# EAGLE schematic Polaczenia (EAGLE 9.6.2)
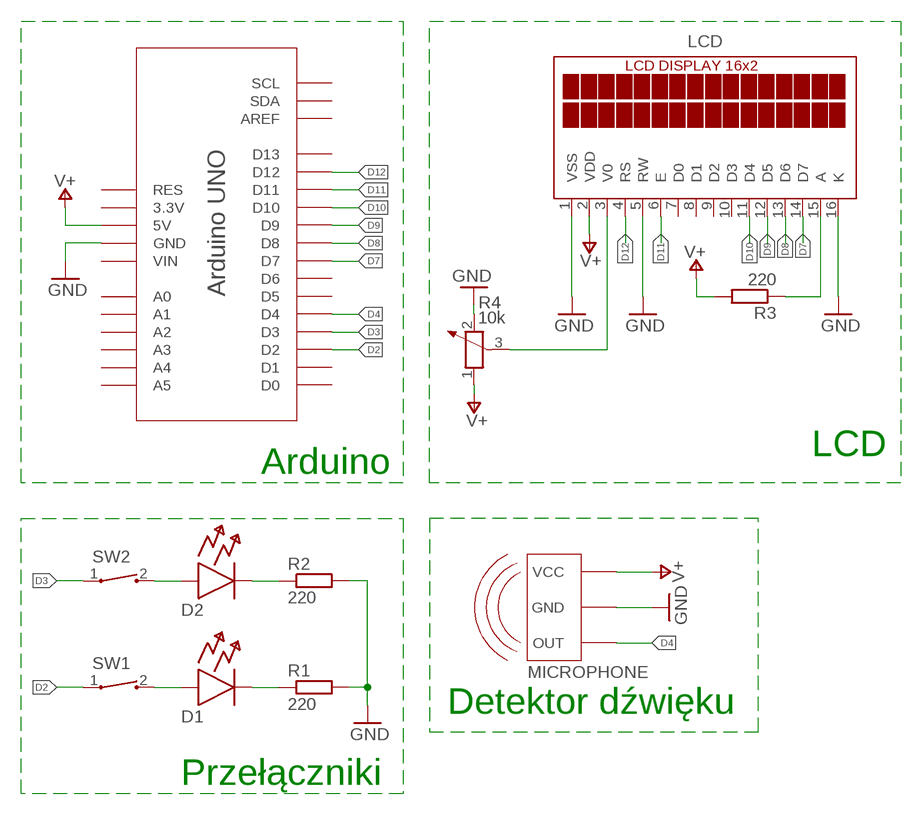
[diagram p0: schematic, sheet 1]

## Parts
D1  LED  (no package)
D2  LED  (no package)
LCD  TUXGR_16X2_R2  [TUXGR_16X2_R2]
MICROPHONE  MIRCROPHONE  (no package)
R1  220  R-EU_0207/10  [0207/10]
R2  220  R-EU_0207/10  [0207/10]
R3  220  R-EU_0207/10  [0207/10]
R4  10k  POTENTIOMETER_PT-10  [PT-10]
SW1  CT10-XXXX-A2  [CT10-XXXX-A2]
SW2  CT10-XXXX-A2  [CT10-XXXX-A2]
U$1  ARDUINO  (no package)

## Nets
D2: SW1.1 U$1.D2
D3: SW2.1 U$1.D3
D4: MICROPHONE.OUT U$1.D4
D7: LCD.14(D7) U$1.D7
D8: LCD.13(D6) U$1.D8
D9: LCD.12(D5) U$1.D9
D10: LCD.11(D4) U$1.D10
D11: LCD.6(E) U$1.D11
D12: LCD.4(RS) U$1.D12
GND: LCD.1(VSS) LCD.5(RW) LCD.16(K) MICROPHONE.GND R1.2 R2.2 R4.2 U$1.GND
N$1: LCD.3(V0) R4.3
N$2: LCD.15(A) R3.1
N$3: D2.C R2.1
N$4: D1.C R1.1
N$5: D1.A SW1.2
N$6: D2.A SW2.2
V+: LCD.2(VDD) MICROPHONE.VCC R3.2 R4.1 U$1.5V
Unconnected: LCD.7(D0) LCD.8(D1) LCD.9(D2) LCD.10(D3) U$1.3.3V U$1.A0 U$1.A1 U$1.A2 U$1.A3 U$1.A4 U$1.A5 U$1.AREF U$1.D0 U$1.D1 U$1.D5 U$1.D6 U$1.D13 U$1.RES U$1.SCL U$1.SDA U$1.VIN

## Notes on the sheet
- Arduino UNO
- LCD
- Arduino
- Detektor dźwięku
- Przełączniki

## Library data of the parts
D1 D2 = ngspice-simulation:LED: Diode
LCD = display-lcd:TUXGR_16X2_R2: Tuxgraphics LCD display 16x2 characters reflective, without background light Source: tuxgr_12x2_r2.pdf; OC_FARNELL: unknown; OC_NEWARK: unknown
MICROPHONE = arduino:MIRCROPHONE
R1-R3 = rcl:R-EU_: RESISTOR, European symbol; SPICEPREFIX: R
R4 = rcl:POTENTIOMETER_: Potentiometer; SPICEMODEL: POT; SPICEPREFIX: X
SW1 SW2 = switch-coto:CT10-XXXX-: CT10 Series Molded Switch Source: www.cotorelay.com .. Coto_Technology__CT10-1530-G1.pdf
U$1 = arduino:ARDUINO